# Altium schematic sheet ClarityMezzanine_V2.SchDoc
size A4; SheetNumber: 1; SheetTotal: 1
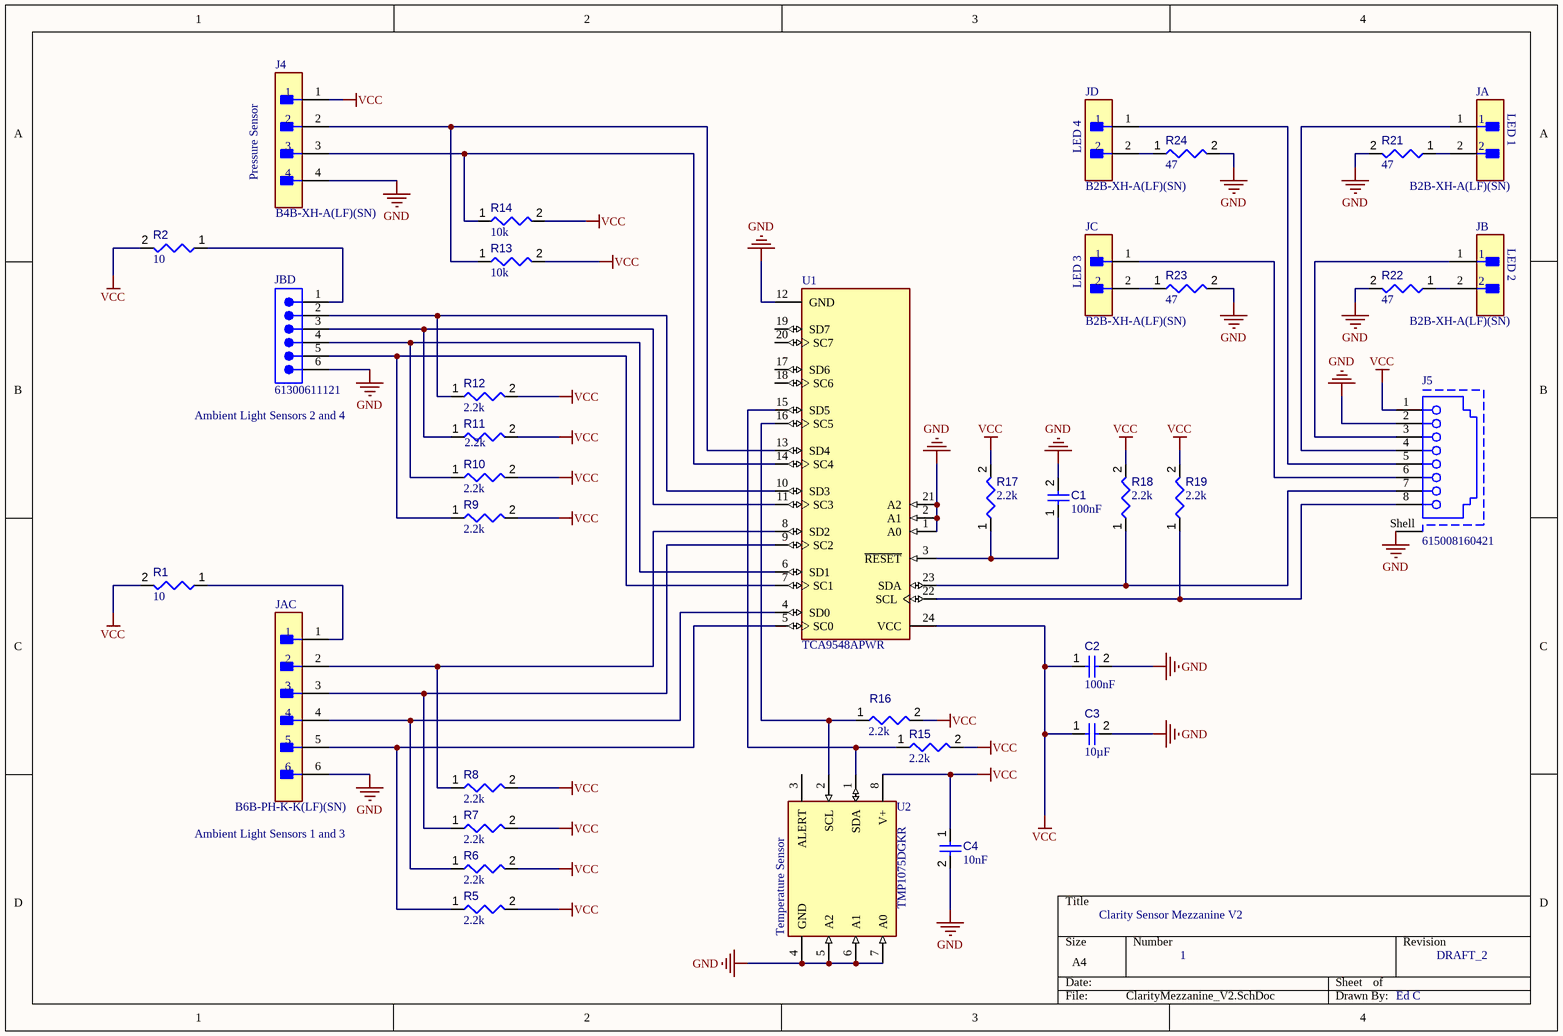
[diagram p0: ClarityMezzanine_V2.SchDoc]

## Parts
C1  value 100nF  [CAPC2013X95X50LL10T25]  (hidden comment: Capacitor 100 nF +/-10% 50 V 0805)
C2  value 100nF  [CAPC2013X95X50LL10T25]  (hidden comment: Capacitor 100 nF +/-10% 50 V 0805)
C3  value 10µF  [CAPC0805(2012)145_L]  (hidden comment: Capacitor 10µF +/-20% 25V 0805)
C4  value 10nF  [FP-C0805C-DN-IPC_A]  (hidden comment: C0805C103K2RACTU)
J4  B4B-XH-A(LF)(SN)  [FP-B4B-XH-A_LF_SN-MFG]
J5  615008160421  [615008160421]
JA  B2B-XH-A(LF)(SN)  [FP-B2B-XH-A_LF_SN-MFG]
JAC  B6B-PH-K-K(LF)(SN)  [FP-B6B-PH-K-K_LF_SN-MFG]
JB  B2B-XH-A(LF)(SN)  [FP-B2B-XH-A_LF_SN-MFG]
JBD  61300611121  [61300611121]
JC  B2B-XH-A(LF)(SN)  [FP-B2B-XH-A_LF_SN-MFG]
JD  B2B-XH-A(LF)(SN)  [FP-B2B-XH-A_LF_SN-MFG]
R1  value 10  [RESC2013X60X35ML10T20]  (hidden comment: RC0805FR-0710RL)
R2  value 10  [RESC2013X60X35ML10T20]  (hidden comment: RC0805FR-0710RL)
R5  value 2.2k  [FP-CRCW0805-e3-IPC_A]  (hidden comment: CRCW08052K20FKEA)
R6  value 2.2k  [FP-CRCW0805-e3-IPC_A]  (hidden comment: CRCW08052K20FKEA)
R7  value 2.2k  [FP-CRCW0805-e3-IPC_A]  (hidden comment: CRCW08052K20FKEA)
R8  value 2.2k  [FP-CRCW0805-e3-IPC_A]  (hidden comment: CRCW08052K20FKEA)
R9  value 2.2k  [FP-CRCW0805-e3-IPC_A]  (hidden comment: CRCW08052K20FKEA)
R10  value 2.2k  [FP-CRCW0805-e3-IPC_A]  (hidden comment: CRCW08052K20FKEA)
R11  value 2.2k  [FP-CRCW0805-e3-IPC_A]  (hidden comment: CRCW08052K20FKEA)
R12  value 2.2k  [FP-CRCW0805-e3-IPC_A]  (hidden comment: CRCW08052K20FKEA)
R13  value 10k  [RESC2013X50X35ML15T15]  (hidden comment: Resistor 10k +/-1% 0805 125 mW)
R14  value 10k  [RESC2013X50X35ML15T15]  (hidden comment: Resistor 10k +/-1% 0805 125 mW)
R15  value 2.2k  [FP-CRCW0805-e3-IPC_A]  (hidden comment: CRCW08052K20FKEA)
R16  value 2.2k  [FP-CRCW0805-e3-IPC_A]  (hidden comment: CRCW08052K20FKEA)
R17  value 2.2k  [FP-CRCW0805-e3-IPC_A]  (hidden comment: CRCW08052K20FKEA)
R18  value 2.2k  [FP-CRCW0805-e3-IPC_A]  (hidden comment: CRCW08052K20FKEA)
R19  value 2.2k  [FP-CRCW0805-e3-IPC_A]  (hidden comment: CRCW08052K20FKEA)
R21  value 47  [FP-ERJ6EN-IPC_B]  (hidden comment: ERJ-6ENF47R0V)
R22  value 47  [FP-ERJ6EN-IPC_B]  (hidden comment: ERJ-6ENF47R0V)
R23  value 47  [FP-ERJ6EN-IPC_B]  (hidden comment: ERJ-6ENF47R0V)
R24  value 47  [FP-ERJ6EN-IPC_B]  (hidden comment: ERJ-6ENF47R0V)
U1  TCA9548APWR  [FP-PW0024A-MFG]
U2  TMP1075DGKR  [FP-DGK0008A-IPC_A]

## Nets
GND: C1.2 C2.2 C3.2 C4.2 J4.4 J5.2 J5.Shell JAC.6 JBD.6 R21.2 R22.2 R23.2 R24.2 U1.1(A0) U1.2(A1) U1.12(GND) U1.21(A2) U2.4(GND) U2.5(A2) U2.6(A1) U2.7(A0)
VCC: C2.1 C3.1 C4.1 J4.1 J5.1 R1.2 R2.2 R5.2 R6.2 R7.2 R8.2 R9.2 R10.2 R11.2 R12.2 R13.2 R14.2 R15.2 R16.2 R17.2 R18.2 R19.2 U1.24(VCC) U2.8(V+)
NetC1_1: C1.1 R17.1 U1.3(~{RESET})
NetJ4_2: J4.2 R13.1 U1.13(SD4)
NetJ4_3: J4.3 R14.1 U1.14(SC4)
NetJ5_3: J5.3 JB.1
NetJ5_4: J5.4 JA.1
NetJ5_5: J5.5 JD.1
NetJ5_6: J5.6 JC.1
NetJ5_7: J5.7 R18.1 U1.23(SDA)
NetJ5_8: J5.8 R19.1 U1.22(SCL)
NetJA_2: JA.2 R21.1
NetJAC_1: JAC.1 R1.1
NetJAC_2: JAC.2 R8.1 U1.8(SD2)
NetJAC_3: JAC.3 R7.1 U1.9(SC2)
NetJAC_4: JAC.4 R6.1 U1.4(SD0)
NetJAC_5: JAC.5 R5.1 U1.5(SC0)
NetJB_2: JB.2 R22.1
NetJBD_1: JBD.1 R2.1
NetJBD_2: JBD.2 R12.1 U1.10(SD3)
NetJBD_3: JBD.3 R11.1 U1.11(SC3)
NetJBD_4: JBD.4 R10.1 U1.6(SD1)
NetJBD_5: JBD.5 R9.1 U1.7(SC1)
NetJC_2: JC.2 R23.1
NetJD_2: JD.2 R24.1
NetR15_1: R15.1 U1.15(SD5) U2.1(SDA)
NetR16_1: R16.1 U1.16(SC5) U2.2(SCL)

Not connected (* = marked no-connect by the designer): U1 17(SD6) 18(SC6) 19(SD7) 20(SC7); U2 3(ALERT)

## Notes on the sheet
- (near JA) LED 1
- (near J4) Pressure Sensor
- (near JD) LED 4
- (near JB) LED 2
- (near JC) LED 3
- (near JBD) Ambient Light Sensors 2 and 4
- Ambient Light Sensors 1 and 3
- Clarity Sensor Mezzanine V2
- (near U2) Temperature Sensor
- 1
- DRAFT_2
- Ed C

## Library data of the parts
C1 C2 = CMP-001-00018-6: Chip Capacitor, 100 nF, +/- 10%, 50 V, 0805 (2012 Metric); Capacitor Type: Ceramic; Voltage Rating: 50V; Pins: 2; Max Operating Temperature: 125°C; Min Operating Temperature: -55°C; Mounting Technology: SM; Case/Package: 0805; RoHS Compliant: True; Tolerance: 10%
C3 = CMP-001-00079-4: Chip Capacitor, 10µF +/-20%, 25V, 0805, Thickness 1.45 mm; Tolerance: 10%; Max Operating Temperature: 85°C; Case/Package: 0805; Voltage Rating: 25V; Min Operating Temperature: -55°C; Mounting Technology: SMT; Pins: 2
C4 = CMP-001-00085-1: Ceramic Capacitor, Multilayer, Ceramic, 200V, 10% +Tol, 10% -Tol, X7R, 15% TC, 0.01uF, Surface Mount, 0805; Capacitor Type: Ceramic; Min Operating Temperature: -55°C; Mounting Technology: Surface Mount; RoHS Compliant: Yes; Pins: 2; Max Operating Temperature: 125°C; Case/Package: 0805
J4 = CMP-002-00071-1: Header for PCB; pitch 2.50mm; 4-contacts; THT male; top entry; 250V/3A
J5 = CMP-002-00078-1: Rj45 Connector, Jack, 8P8C, 1Port Rohs Compliant: Yes
JA JB JC JD = CMP-002-00073-1: CONNECTOR HEADER, XH SERIES, 2 POSITION, 2.50MM, Press-Fit Solder, Detent Lock, Natural
JAC = CMP-002-00087-1: PH Series 6 Position 2 mm Pitch Through Hole Top Entry Shrouded Header
JBD = CMP-002-00086-1: Board Connector, 6 Contact(s), 1 Row(s), Male, Straight, 0.1 inch Pitch, Solder Terminal, Locking, Black Insulator, Plug; Max Operating Temperature: 125°C; Connector Type: BOARD CONNECTOR; Min Operating Temperature: -40°C; Mounting Technology: Board; RoHS Compliant: Yes
R1 R2 = CMP-009-00178-1: Fixed Resistor, Metal Glaze/thick Film, 0.125W, 10ohm, 150V, 1% +/-Tol, 200ppm/Cel, Surface Mount, 0805; Power: 125mW; RoHS Compliant: Yes; Min Operating Temperature: -55°C; Mounting Technology: Surface Mount; Pins: 2; Max Operating Temperature: 155°C; Tolerance: 1%; Case/Package: 0805
R5-R12 R15-R19 = CMP-009-00182-1: Fixed Resistor, Metal Glaze/thick Film, 0.125W, 2200ohm, 150V, 1% +/-Tol, 100ppm/Cel, Surface Mount, 0805; Power: 125mW; RoHS Compliant: Yes; Case/Package: 0805; Max Operating Temperature: 155°C; Tolerance: 1%; Pins: 2; Mounting Technology: Surface Mount; Min Operating Temperature: -55°C
R13 R14 = CMP-009-00018-5: Chip Resistor, 10 KOhm, +/- 1%, 125 mW, -55 to 155 degC, 0805 (2012 Metric); Power: 125mW; Voltage Rating: 150V; Tolerance: 1%; Pins: 2; Min Operating Temperature: -55°C; Case/Package: 0805; Max Operating Temperature: 155°C; RoHS Compliant: True; Mounting Technology: SM
R21-R24 = CMP-009-00177-1: Fixed Resistor, Metal Glaze/thick Film, 0.125W, 47ohm, 150V, 1% +/-Tol, 100ppm/Cel, Surface Mount, 0805; Power: 125mW; RoHS Compliant: Yes; Tolerance: 1%; Mounting Technology: Surface Mount; Min Operating Temperature: -55°C; Max Operating Temperature: 155°C; Case/Package: 0805; Pins: 2
U1 = CMP-031-00006-1: Multiplexer, 9548 Series, 1-Func, 1 Line Input, 8 Line Output, True Output, PDSO24; Min Supply Voltage: 1.65V; Max Supply Voltage: 5.5V; Case/Package: TSSOP; RoHS Compliant: Yes; Max Operating Temperature: 85°C; Min Operating Temperature: -40°C; Pins: 24
U2 = CMP-010-00026-1: Serial Switch/Digital Sensor, 12 Bit(s), 2Cel, Square, Surface Mount; Sensor Type: TEMPERATURE SENSOR,SWITCH/DIGITAL OUTPUT,SERIAL; RoHS Compliant: Yes